# EasyEDA Pro project 2025-06-28（请勿使用）.epro, board PCB1
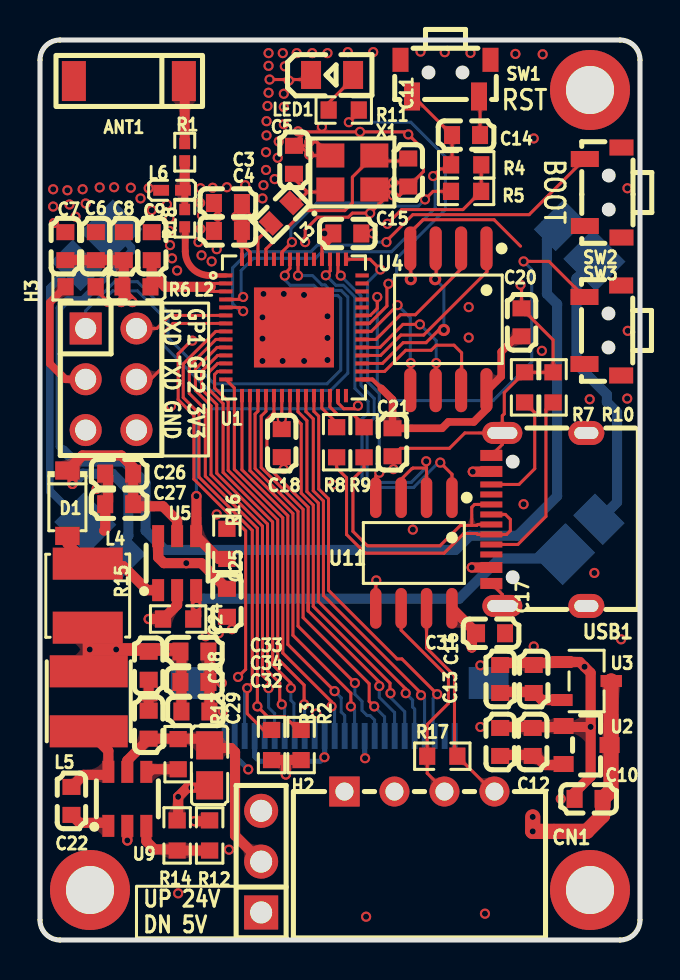
[diagram p1: board, top side]
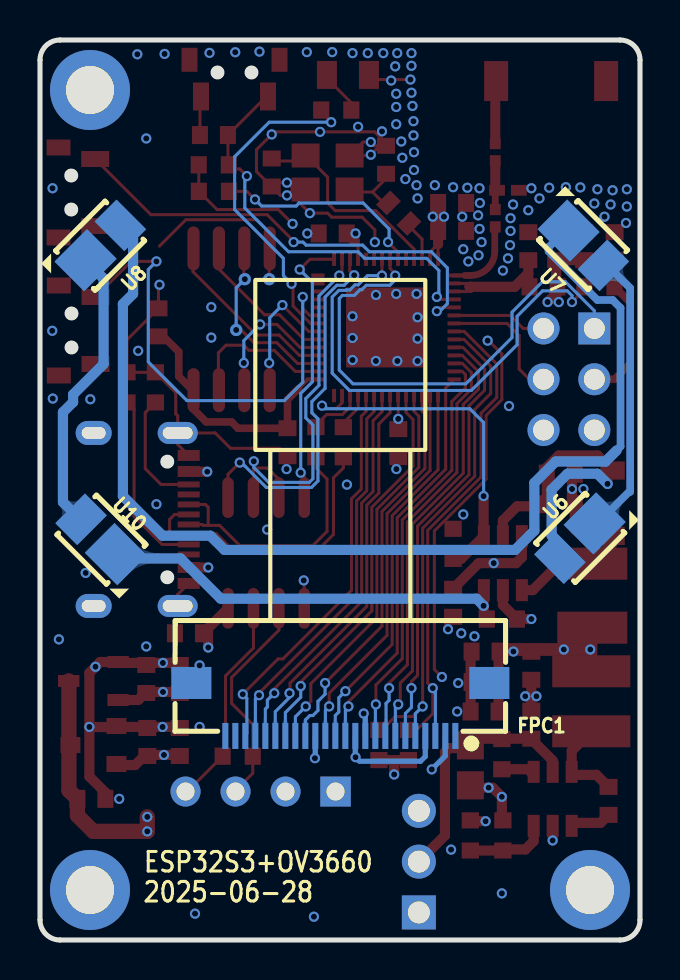
[diagram p2: board, bottom side, seen from below]

Outline 30 x 45 mm; copper layers: Top Layer, Inner1, Inner2, Bottom Layer. Coordinates in mm from the lower left corner of the outline.
Outline path: 0,44 0,1 arc(0.29,0.29) 1,0 29,0 arc(29.71,0.29) 30,1 30,44 arc(29.71,44.71) 29,45 1,45 arc(0.29,44.71) 0,44
Stack: Top Layer 0.035mm 外层铜厚1oz / Dielectric1 0.2104mm 7628 RC49% 8.6mil / Inner1 0.0152mm 内层铜厚 / Dielectric2 1.065mm 1.1mm H/HOZ 含铜 / Inner2 0.0152mm 内层铜厚 / Dielectric3 0.2104mm 7628 RC49% 8.6mil / Bottom Layer 0.035mm 外层铜厚1oz

## Design rules (mm)
net USB_D-: DP1
net USB_D+: DP1
template: 自定义配置
spacing copperThickness1oz (default): track to track 0.102, other pairs 0.152 to 0.3
spacing copperThickness2oz: track to track 0.203, other pairs 0.152 to 0.3
track width copperThickness1oz (default): min 0.127, default 0.254, max 2.54
track width copperThickness2oz: min 0.203, default 0.254, max 2.54
differential pair differentialPair (default): width min 0.127, default 0.254, max 2.54; gap min 0.152, default 0.152
via viaSize (default): diameter min 0.5, default 0.508, max 10; hole min 0.3, default 0.305, max 6.299

## Placement (name value [footprint] x y rotation side)
ANT1  -  [CA-C03]  4.44 42.95 180 top
C3  10nF  [C0603]  9.4 36.85 0 top
C4  1uF  [C0603]  9.4 35.45 0 top
C5  12pF  [C0603]  12.7 39.01 90 top
C6  10uF  [C0603]  2.79 34.69 270 top
C7  1uF  [C0603]  1.27 34.69 270 top
C8  100nF  [C0603]  4.19 34.69 270 top
C9  100nF  [C0603]  5.59 34.69 270 top
C10  10uF  [C0603]  27.43 7.06 0 top
C11  12pF  [C0603]  18.41 38.38 90 top
C12  100nF  [C0603]  24.64 9.9 270 top
C13  10uF  [C0603]  23.01 9.9 270 top
C14  1uF  [C0603]  21.3 40.25 180 top
C15  100nF  [C0603]  15.37 35.33 180 top
C16  100nF  [C0603]  23.01 13.05 270 top
C17  10uF  [C0603]  24.69 13.05 270 top
C18  100nF  [C0603]  12.09 24.84 90 top
C20  100nF  [C0603]  24.08 30.88 270 top
C21  1uF  [C0603]  17.63 24.89 90 top
C22  100nF  [C0603]  1.57 6.95 270 top
C24  10uF  [C0603]  5.43 13.71 90 top
C25  1uF  [C0603]  9.34 16.86 90 top
C26  1uF  [C0603]  3.96 23.31 0 top
C27  1uF  [C0603]  3.96 21.79 0 top
C28  100nF  [C0603]  5.43 10.77 90 top
C29  22uF  [C0805]  8.48 8.73 90 top
C31  100nF  [C0603]  22.55 15.34 0 top
C32  10uF  [C0603]  7.77 11.43 180 top
C33  10uF  [C0603]  7.72 14.42 180 top
C34  10uF  [C0603]  7.72 12.9 180 top
CN1  ZX-XH2.54-4PWZ  [CONN-TH_4P-P2.50_ZX-XH2.54-4PWZ]  18.97 7.42 0 top
D1  1N5819W  [SOD-123_L2.7-W1.6-LS3.7-RD]  1.37 21.84 270 top
FPC1  AFC01-S24FCA-00  [FPC-SMD_24P-P0.50_AFC01-S24FCA-00]  14.98 11.53 0 bottom
H2  PZ254V-11-03P  [HDR-TH_3P-P2.54-V-M]  11.06 3.92 90 top
H3  2.54-2*3  [HDR-TH_6P-P2.54-V-R2-C3-S2.54_A2541WV-2X3P]  3.55 28.04 270 top
L2  2nH  [L0603]  4.82 32.66 0 top
L3  24nH  [IND-SMD_L1.6-W0.8]  12.06 36.34 45 top
L4  22uH  [IND-SMD_L4.0-W4.0]  2.39 17.22 90 top
L5  10uH  [IND-SMD_L4.0-W4.0_FNR40XXS]  2.44 11.93 90 top
L6  3nH  [L0402]  6.6 37.49 0 top
LED1  NCD0805R1  [LED0805-R-RD]  14.6 43.25 0 top
NOREF  -  [Pad_e84]  27.5 2.5 0 top
NOREF#2  -  [Pad_e89]  27.5 42.5 0 top
NOREF#3  -  [Pad_e87]  2.5 2.5 0 top
R1  0Ω  [R0402]  7.24 39.39 270 top
R2  4.7kΩ  [R0603]  13.05 9.75 270 top
R3  4.7kΩ  [R0603]  11.58 9.75 270 top
R4  10kΩ  [R0603]  21.31 38.76 0 top
R5  10kΩ  [R0603]  21.3 37.43 0 top
R6  499Ω  [R0603]  2.03 32.66 180 top
R7  5.1kΩ  [R0603]  24.23 27.63 270 top
R8  22Ω  [R0603]  14.83 24.89 90 top
R9  22Ω  [R0603]  16.2 24.89 90 top
R10  5.1kΩ  [R0603]  25.65 27.63 270 top
R11  10kΩ  [R0603]  15.19 41.5 0 top
R12  7.5kΩ  [R0603]  8.48 5.23 90 top
R13  10kΩ  [R0603]  6.91 9.29 90 top
R14  2.4kΩ  [R0603]  6.86 5.23 270 top
R15  5.1Ω  [R0603]  6.91 16.05 0 top
R16  10kΩ  [R0603]  9.34 19.81 270 top
R17  120Ω  [R0603]  20.12 9.19 0 top
R18  0Ω  [R0402]  7.24 36.09 270 top
SW1  TS24CA 250gf 013  [SW-SMD_L4.7-W3.5-P3.35-EH]  20.28 43.09 0 top
SW2  TS24CA 250gf 013  [SW-SMD_L4.7-W3.5-P3.35-EH]  28.16 37.37 270 top
SW3  TS24CA 250gf 013  [SW-SMD_L4.7-W3.5-P3.35-EH]  28.14 30.48 270 top
U1  ESP32-S3R8  [QFN-56_L7.0-W7.0-P0.40-TL-EP4.0]  12.7 30.63 0 top
U2  ME6206A28XG  [SOT-23_L2.9-W1.3-P1.90-LS2.4-BR]  27.33 9.75 180 top
U3  ME6206A15XG  [SOT-23-3_L2.9-W1.6-P1.90-LS2.8-BR]  27.33 12.95 180 top
U4  W25Q64JVSSIQ  [SOP-8_L5.3-W5.3-P1.27-LS8.0-BL]  20.42 31.03 180 top
U5  SY7200AABC  [SOT-23-6_L2.9-W1.6-P0.95-LS2.8-BR]  6.86 18.84 270 top
U6  A2835W6H2-D01-8D2AB5  [LED-SMD_L3.5-W2.8-FD-2835_WHITE]  3.14 19.96 135 bottom
U7  A2835W6H2-D01-8D2AB5  [LED-SMD_L3.5-W2.8-FD-2835_WHITE]  2.7 34.6 45 bottom
U8  A2835W6H2-D01-8D2AB5  [LED-SMD_L3.5-W2.8-FD-2835_WHITE]  26.85 34.86 315 bottom
U9  JW5026  [SOT-23-6_L2.9-W1.6-P0.95-LS2.8-BR]  4.37 7.06 270 top
U10  A2835W6H2-D01-8D2AB5  [LED-SMD_L3.5-W2.8-FD-2835_WHITE]  27.07 20.16 225 bottom
U11  SP3485EEN(UMW)  [SOP-8_L5.0-W4.0-P1.27-LS6.0-BL]  18.69 19.35 180 top
USB1  TYPE-C 16PIN 2MD(073)  [USB-C-SMD_TYPE-C-6PIN-2MD-073]  24.94 21.03 90 top
X1  40MHz  [CRYSTAL-SMD_4P-L3.2-W2.5-BL_SIT8008BI]  15.62 38.38 0 top

## Footprints (pads in the part's own frame, mm; a bottom-side part is the same pattern mirrored in y, then rotated)
C0603
  rect 0.8x0.9 smd: 1(-0.7,0) 2(0.7,0)
C0805
  rect 1.41x1.35 smd: 1(-1,0) 2(1,0)
CA-C03
  rect 1.2x2 smd: 1(-2.75,0) 2(2.75,0)
CONN-TH_4P-P2.50_ZX-XH2.54-4PWZ
  rect 1.524x1.5 hole 0.9: 1(-3.75,0)
  round 1.5 hole 0.9: 2(-1.25,0) 3(1.25,0) 4(3.75,0)
CRYSTAL-SMD_4P-L3.2-W2.5-BL_SIT8008BI
  rect 1.4x1.2 smd: 1(-1.1,-0.85) 2(1.1,-0.85) 3(1.1,0.85) 4(-1.1,0.85)
FPC-SMD_24P-P0.50_AFC01-S24FCA-00
  rect 0.3x1.3 smd: 1(-5.75,1.325) 2(-5.25,1.325) 3(-4.75,1.325) 4(-4.25,1.325) 5(-3.75,1.325) 6(-3.25,1.325) 7(-2.75,1.325) 8(-2.25,1.325) 9(-1.75,1.325) 10(-1.25,1.325) 11(-0.75,1.325) 12(-0.25,1.325) 13(0.25,1.325) 14(0.75,1.325) 15(1.25,1.325) 16(1.75,1.325) 17(2.25,1.325) 18(2.75,1.325) 19(3.25,1.325) 20(3.75,1.325) 21(4.25,1.325) 22(4.75,1.325) 23(5.25,1.325) 24(5.75,1.325)
  rect 2x1.6 smd: 25(7.449,-1.325) 26(-7.45,-1.325)
HDR-TH_3P-P2.54-V-M
  rect 1.7x1.7 hole 1.1: 1(-2.54,0)
  round 1.7 hole 1.1: 2(0,0) 3(2.54,0)
HDR-TH_6P-P2.54-V-R2-C3-S2.54_A2541WV-2X3P
  rect 1.6x1.6 hole 1.05: 1(-2.54,-1.27)
  round 1.6 hole 1.05: 2(-2.54,1.27) 3(0,-1.27) 4(0,1.27) 5(2.54,-1.27) 6(2.54,1.27)
IND-SMD_L1.6-W0.8
  rect 0.762x1 smd: 1(-0.724,0) 2(0.724,0)
IND-SMD_L4.0-W4.0
  rect 1.6x3.5 smd: 1(-1.6,0) 2(1.6,0)
IND-SMD_L4.0-W4.0_FNR40XXS
  rect 1.6x3.9 smd: 1(-1.5,0) 2(1.5,0)
L0402
  rect 0.79x0.54 smd: 1(-0.545,0) 2(0.545,0)
L0603
  rect 0.8x0.864 smd: 1(-0.7,0) 2(0.7,0)
LED0805-R-RD
  rect 1x1.399 smd: 1(1.05,0) 2(-1.05,0)
LED-SMD_L3.5-W2.8-FD-2835_WHITE
  rect 2.3x2.1 smd: 1(1.231,0)
  rect 1.55x2.1 smd: 2(-1.232,0)
Pad_e84
  round 4 hole 2.4: 1(0,0)
Pad_e87
  round 4 hole 2.4: 1(0,0)
Pad_e89
  round 4 hole 2.4: 1(0,0)
QFN-56_L7.0-W7.0-P0.40-TL-EP4.0
  rect 0.665x0.2 smd: 1(-3.408,2.6) 2(-3.408,2.2) 3(-3.408,1.8) 4(-3.408,1.4) 5(-3.408,1) 6(-3.408,0.6) 7(-3.408,0.2) 8(-3.408,-0.2) 9(-3.408,-0.6) 10(-3.408,-1) 11(-3.408,-1.4) 12(-3.408,-1.8) 13(-3.408,-2.2) 14(-3.408,-2.6) 29(3.408,-2.6) 30(3.408,-2.2) 31(3.408,-1.8) 32(3.408,-1.4) 33(3.408,-1) 34(3.408,-0.6) 35(3.408,-0.2) 36(3.408,0.2) 37(3.408,0.6) 38(3.408,1) 39(3.408,1.4) 40(3.408,1.8) 41(3.408,2.2) 42(3.408,2.6)
  rect 0.2x0.665 smd: 15(-2.6,-3.408) 16(-2.2,-3.408) 17(-1.8,-3.408) 18(-1.4,-3.408) 19(-1,-3.408) 20(-0.6,-3.408) 21(-0.2,-3.408) 22(0.2,-3.408) 23(0.6,-3.408) 24(1,-3.408) 25(1.4,-3.408) 26(1.8,-3.408) 27(2.2,-3.408) 28(2.6,-3.408) 43(2.6,3.408) 44(2.2,3.408) 45(1.8,3.408) 46(1.4,3.408) 47(1,3.408) 48(0.6,3.408) 49(0.2,3.408) 50(-0.2,3.408) 51(-0.6,3.408) 52(-1,3.408) 53(-1.4,3.408) 54(-1.8,3.408) 55(-2.2,3.408) 56(-2.6,3.408)
  rect 4x4 smd: 57(0,0)
R0402
  rect 0.566x0.54 smd: 1(-0.433,0) 2(0.433,0)
R0603
  rect 0.806x0.864 smd: 1(-0.753,0) 2(0.753,0)
SOD-123_L2.7-W1.6-LS3.7-RD
  rect 0.91x1.22 smd: 1(-1.635,0) 2(1.635,0)
SOP-8_L5.0-W4.0-P1.27-LS6.0-BL
  oval 0.574x2.035 smd: 1(-1.905,-2.768) 2(-0.635,-2.768) 3(0.635,-2.768) 4(1.905,-2.768) 5(1.905,2.768) 6(0.635,2.768) 7(-0.635,2.768) 8(-1.905,2.768)
SOP-8_L5.3-W5.3-P1.27-LS8.0-BL
  oval 0.609x2.204 smd: 1(-1.905,-3.542) 2(-0.635,-3.542) 3(0.635,-3.542) 4(1.905,-3.542) 5(1.905,3.542) 6(0.635,3.542) 7(-0.635,3.542) 8(-1.905,3.542)
SOT-23-3_L2.9-W1.6-P1.90-LS2.8-BR
  rect 1.07x0.6 smd: 1(1.235,-0.95) 2(1.235,0.95) 3(-1.235,0)
SOT-23-6_L2.9-W1.6-P0.95-LS2.8-BR
  rect 1.1x0.6 smd: 1(1.35,-0.95) 2(1.35,0) 3(1.35,0.95) 4(-1.35,0.95) 5(-1.35,0) 6(-1.35,-0.95)
SOT-23_L2.9-W1.3-P1.90-LS2.4-BR
  rect 1x0.8 smd: 1(1.15,-0.95) 2(1.15,0.95) 3(-1.15,0)
SW-SMD_L4.7-W3.5-P3.35-EH
  rect 0.8x1.4 smd: 1(-1.675,-0.917) 2(1.675,-0.917)
  rect 0.8x1.2 smd: 3(-2.25,0.917) 4(2.25,0.917)
USB-C-SMD_TYPE-C-6PIN-2MD-073
  rect 0.55x1.1 smd: 1(-3.2,2.375) 2(-2.4,2.375) 11(2.4,2.375) 12(3.2,2.375)
  rect 0.3x1.1 smd: 3(-1.75,2.375) 4(-1.25,2.375) 5(-0.75,2.375) 6(-0.25,2.375) 7(0.25,2.375) 8(0.75,2.375) 9(1.25,2.375) 10(1.75,2.375)
  oval 1.1x2 hole 0.6x1.5: 13(-4.325,1.825) 14(4.325,1.825)
  oval 1.2x1.8 hole 0.6x1.2: 13(-4.325,-2.375) 14(4.325,-2.375)

## Nets
As in the schematic, except:
GND: C3.1 C4.1 C5.2 C6.1 C7.1 C8.1 C9.1 C10.1 C11.1 C12.1 C13.1 C14.1 C15.1 C16.1 C17.1 C18.1 C20.1 C21.1 C24.1 C25.1 C26.1 C27.1 C28.2 C29.1 C31.2 C32.1 C33.1 C34.1 CN1.2 FPC1.2 FPC1.15 FPC1.25 FPC1.26 H3.5 L6.1 LED1.2 NOREF.1 NOREF#2.1 NOREF#3.1 R7.1 R10.1 R14.1 R15.1 R16.1 SW1.2 SW1.3 SW1.4 SW2.2 SW2.3 SW2.4 SW3.2 SW3.3 SW3.4 U1.57 U2.1 U3.1 U4.4 U5.2 U9.2 U11.5 USB1.1 USB1.12 USB1.13 USB1.14 X1.2 X1.4

Pads without a net: ANT1 2; FPC1 1 23 24; U1 28 38 39 40 41 42 47 48 52; USB1 3 9

## Via types
v1: diameter 0.508, hole 0.299, Top Layer to Bottom Layer, 43 vias
v2: diameter 0.508, hole 0.305, Top Layer to Bottom Layer, 154 vias
v3: diameter 0.61, hole 0.305, Top Layer to Bottom Layer, 3 vias

## Routing (per net, layer and track width the routed paths; a pad name or vN(x,y) marks a point on that pad's centre or on a via; arc(x,y) is an arc through that point)
5V: length 1.9
  Top Layer w0.508: v1(21.59,18.63) USB1.2 ; v1(21.64,23.41) 22.55,23.41 USB1.11
24V_5V: length 12.9
  Top Layer w0.508: H2.2 9.75,5.22 9.75,9.39 9.55,9.6 8.62,9.6 C29.2 8.15,10.06 C28.1 5.43,10.04 4.37,8.97 4.37,8.26
GND: length 109.4
  Top Layer w0.152: 18.48,33.57 18.48,35.35 19.15,36.01 22.71,36.01 24.03,34.69 ; C21.1 18.02,24.58 20.47,24.58 21.24,25.35 USB1.14 ; C14.1 22,42.12 SW1.2 ; 13.01,39.71 v2(13.46,39.26) 13.5,39.22 X1.4 13.84,39.9 v2(13.46,39.9) 13.27,39.71 13.01,39.71 ; 13.01,39.71 12.57,39.71 13.27,40.41 v2(16,40.41) 18.29,40.41 v2(18.41,40.28) 19.18,39.52 19.18,38.43 17.98,37.23 17.97,37.23 ; 17.31,37.53 X1.2 ; 17.31,37.53 v2(17.65,37.87) 18.22,37.87 C11.1 17.97,37.23 ; 17.31,37.53 17.36,37.53 v2(17.65,37.23) ; v2(11.48,43.02) 13.12,43.02 13.55,43.45 ; USB1.14 23.12,26.21 23.21,26.31 23.21,27.37 R7.1 R10.1 25.65,30.01 C20.1 24.08,32.71 v1(24.03,32.76) ; USB1.14 23.12,24.78 USB1.12 ; v1(9.9,13.15) 10.28,13.53 10.28,20.45 7.69,23.04 7.69,26.23 6.91,27.02 6.91,29.31 7.57,29.97 v2(7.62,29.97) ; v3(18.54,33.04) 18.54,34.55 ; v2(17.65,37.23) 17.4,37.23 v2(16.51,36.34) 15.62,36.34 15.42,36.14 13.89,36.14 13.26,35.5 v2(13.26,34.89) ; v2(17.65,37.23) 17.97,37.23 ; v2(16.81,17.98) 16.79,17.95 U11.5 ; v1(9.09,12.85) 8.47,12.85 C34.1 ; USB1.13 23.12,17.28 USB1.1
  Top Layer w0.508: v2(27.53,10.66) 27.53,8.17 26.73,7.37 C10.1 ; v2(27.53,10.66) 27.53,13.36 v2(27.23,13.66) 26.99,13.9 26.19,13.9 26.15,13.85 v2(23.86,13.85) 22.96,13.85 ; v2(27.53,10.66) 27.53,10.65 26.25,10.65 26.24,10.65 v2(23.87,10.65) 23.01,10.65 ; C33.1 8.47,14.37 C32.1 ; C24.1 C28.2 ; v1(4.37,4.98) 4.37,5.86 ; v1(5.43,16.05) R15.1 6.86,16.75 U5.2 ; R14.1 6.91,6.03 v1(6.91,7.16) 7.36,7.62 v1(7.57,7.62) 8.36,7.62 C29.1 ; C26.1 3.4,23.17 v2(3.4,22.55) 3.4,21.93 C27.1 3.26,20.52 3.21,20.47
  Bottom Layer w0.152: v2(16.81,17.98) 16.81,17.93
  Bottom Layer w0.254: v2(16.25,9.09) 16.23,9.11 FPC1.15 ; FPC1.2 9.73,9.21 v2(10.41,8.53)
  vias: v1(5.18,12.19) v1(5.74,12.19) v1(8.28,15.19) v1(8.94,15.34) v1(9.6,15.54) v1(11.12,31.14) v1(11.17,32.3) v1(21.44,30.12) v1(27.49,27.04) v1(27.72,18.35) v2(0.66,37.54) v2(0.66,36.67) v2(0.7,35.85) v2(1.37,37.49) v2(1.47,36.78) v2(1.78,36.17) v2(2.13,37.54) v2(2.28,36.83) v2(2.83,22.55) v2(2.98,37.63) v2(3.71,37.64) v2(4.54,37.61) v2(5.03,37.08) v2(5.43,37.59) v2(5.59,36.49) v2(6.35,36.78) v2(6.47,36.09) v2(6.47,35.45) v2(6.5,34.74) v2(6.6,34.08) v2(6.55,26.7) v2(6.86,33.47) v2(6.91,2.33) v2(7.92,34.89) v2(8.02,37.59) v2(8.01,36.85) v2(8.02,35.56) v2(8.1,36.23) v2(8.07,34.23) v2(8.63,37.61) v2(8.58,33.93) v2(8.84,34.54) v2(8.84,21.28) v2(8.89,36.17) v2(9.14,11.43) v2(9.34,37.64) v2(9.45,4.52) v2(10.26,37.74) v2(11.12,37.08) v2(11.12,30.07) v2(11.12,28.95) v2(11.17,37.74) v2(11.33,40.94) v2(11.33,40.23) v2(11.3,39.39) v2(11.3,38.5) v2(11.43,44.34) v2(11.43,43.71) v2(11.43,42.36) v2(11.38,41.7) v2(11.73,38.05) v2(11.94,39.92) v2(11.88,39.11) v2(12.14,44.34) v2(12.13,28.95) v2(12.24,43.68) v2(12.19,42.31) v2(12.19,41.65) v2(12.19,40.79) v2(12.19,32.3) v2(12.18,23.55) v2(12.44,42.97) v2(12.84,44.34) v2(12.9,40.43) v2(13.2,32.25) v2(13.21,28.95) v2(13.61,44.34) v2(14.09,40.66) v2(14.37,44.34) v2(14.37,31.19) v2(14.37,30.1) v2(14.37,29) v2(14.66,22.77) v2(15.39,44.39) v2(16.31,1.16) v2(16.63,35.33) v2(16.66,44.39) v2(17.67,23.54) v2(18.64,20.52) v2(19.03,44.42) v2(20.24,44.39) v2(21.44,31.64) v2(21.53,44.35) v2(22.02,13.73) v2(22.02,10.65) v2(22.25,1.32) v2(23.77,44.3) v2(24.18,21.79) v2(24.69,40.08) v2(24.69,14.68) v2(25.13,44.29) v2(25.09,29.46) v2(26.04,7.06) v2(29.06,15.03) v2(29.37,37.59) v2(29.39,30.46) v2(29.36,27.07)
VDD3P3: length 6.8
  Top Layer w0.152: 8.44,32.66 8.27,32.83 U1.2 ; U1.3 8.67,32.43 8.49,32.61
  Top Layer w0.508: 5.59,33.34 6.26,32.66 8.52,32.66 8.48,32.62 8.49,32.61 ; 5.59,33.34 5.59,32.72 L2.2 ; 5.59,33.34 C9.2
VDD_SPI: length 13
  Top Layer w0.203: U1.29 16.62,28.03 17.07,27.58
  Top Layer w0.381: 17.07,27.58 17.63,27.02 C21.2 20.1,25.59 20.42,25.9 21.69,25.9 22.35,26.56 22.35,27.47 23.06,28.18 23.06,29.41 23.83,30.18 C20.2
1P5V: length 4.6
  Top Layer w0.508: 22.96,12.45 23.01,12.4 v2(23.85,12.4) 24.69,12.4 25.09,12 26.19,12
  Bottom Layer w0.254: v1(13.82,11.32) 13.73,11.24 FPC1.10
2P8V: length 9.3
  Top Layer w0.508: 26.25,8.75 25.24,8.75 24.69,9.3 24.64,9.25 v2(23.8,9.25) 23.01,9.25
  Bottom Layer w0.254: FPC1.11 14.23,9.15 v1(14.22,9.14) 14.02,8.94 10.97,8.94 10.73,9.17 FPC1.4
3P3V: length 53.4
  Top Layer w0.152: 12.29,8.99 12.29,9 ; C18.2 12.09,25.55 v2(12.09,26.06) 12.09,27.21 U1.20 ; C3.2 10.36,36.59 v2(10.36,36.17) ; 14.66,35.33 v2(14.22,35.33) 14.1,35.2 U1.46 ; U1.56 10.1,34.8 10.5,34.4 U1.55 ; R4.2 22.06,37.44 R5.2 21.15,36.52 18.08,36.52 v2(17.37,35.81)
  Top Layer w0.508: C7.2 C6.2 C8.2 4.19,32.72 ; 4.82,25.59 5.01,25.59 ; 4.82,25.59 4.82,25.62 ; 4.82,25.59 4.55,25.59 4.4,25.45 ; 4.19,32.33 4.12,32.39 L2.1 ; 4.19,32.33 v2(4.62,31.9) ; 4.19,32.33 4.19,32.03 v2(4.06,31.9) ; R3.2 R2.2 ; U11.8 21.6,15.58 21.6,14.64 v2(21.59,14.63) ; C3.2 C4.2 10.1,34.8 10.1,34.8 ; U5.6 5.91,19.13 6.2,18.84 v2(7.31,18.84) 8.06,18.84 C25.2 ; L4.1 2.39,13.48 2.44,13.43 ; R12.2 8.44,5.94 v1(7.72,5.94) ; C32.2 7.07,14.37 C33.2 ; v2(12.29,8.28) 12.29,8.99 ; 14.66,35.33 14.27,34.94 14.27,34.89
  Top Layer w0.635: v1(2.49,14.52) v1(3.81,14.52) 6.92,14.52 C33.2
  Top Layer w0.762: v2(24.64,6.16) v2(24.64,5.43) 27.34,5.43 28.13,6.23 C10.2 28.55,7.48 28.55,12.94 U3.3
  vias: v2(6.33,14.42) v2(9.8,36.17)
485_A: length 11
  Top Layer w0.152: 20.27,7.42 19.36,8.33 R17.1 19.36,10.77 20.42,11.83 20.42,13.13 18.06,15.49 U11.6
485_B: length 10.7
  Top Layer w0.152: U11.7 19.33,14.6 20.72,13.2 20.72,9.33 R17.2 22.64,7.42 22.77,7.42
485_EN: length 19.8
  Top Layer w0.152: 19.33,23.6 18.65,23.6 18.62,23.57 18.59,23.57 18.06,23.03 U11.3 ; 19.33,23.6 U11.2 ; 19.33,23.6 19.31,23.61 v2(19.31,23.94) ; U1.44 14.9,33.36 v2(15.04,33.22)
  Bottom Layer w0.152: v2(15.04,33.22) 16.05,32.2 16.05,27.73 16.71,27.07 16.71,26.11 16.36,25.75 16.36,23.06 16.53,22.88 18.57,22.88 19.31,23.63 v2(19.31,23.94)
BOOT: length 23.3
  Top Layer w0.152: v1(10.16,31.44) 9.97,31.63 U1.5 ; SW2.1 24.46,36.27 18.64,36.27 17.32,34.95 v2(17.32,34.89)
  Bottom Layer w0.152: v2(17.32,34.89) 16.85,34.89 16.7,34.74 13.87,34.74 13.54,34.41 10.44,34.41 9.63,33.61 9.63,31.81 10.01,31.44 v1(10.16,31.44)
D2: length 19.3
  Top Layer w0.152: U1.21 12.5,26.36 13.06,25.8 13.06,22.35 13.66,21.74 13.66,16.68 17.5,12.84 17.5,12.36 v1(17.52,12.34)
  Bottom Layer w0.152: 18.24,10.26 18.24,11.41 17.52,12.12 v1(17.52,12.34)
D3: length 19.4
  Top Layer w0.152: v1(19.05,12.24) 19.05,12.34 14.17,17.22 14.17,21.95 13.66,22.46 13.66,26.06 13.3,26.42 U1.23
  Bottom Layer w0.152: 19.23,10.26 19.23,12.06 v1(19.05,12.24)
D4: length 19.8
  Top Layer w0.152: v1(19.86,12.29) 18.1,14.05 17.86,14.05 14.43,17.48 14.43,22.06 13.94,22.55 13.94,26.19 13.7,26.43 U1.24
  Bottom Layer w0.152: 19.73,10.26 19.66,10.34 19.66,12.09 v1(19.86,12.29)
D5: length 19.4
  Top Layer w0.152: v1(18.29,12.34) 18.29,12.56 13.92,16.92 13.92,21.85 13.35,22.42 13.35,25.97 12.9,26.42 U1.22
  Bottom Layer w0.152: v1(18.29,12.34) 18.63,11.99 18.63,11.65 18.73,11.55 FPC1.20
D6: length 20.1
  Top Layer w0.152: U1.19 11.7,26.38 11.35,26.02 11.35,23.7 13.41,21.64 13.41,16.45 ; v1(16.97,12.7) 16.97,12.9 13.41,16.45 ; 13.41,16.45 13.41,16.85
  Bottom Layer w0.152: v1(16.97,12.7) 16.97,12.14 17.73,11.37 17.73,10.26
D7: length 19.6
  Top Layer w0.152: U1.17 10.9,26.44 10.75,26.3 10.75,23.57 12.9,21.43 12.9,15.69 v1(15.75,12.85)
  Bottom Layer w0.152: v1(15.75,12.85) 15.75,12.29 16.1,11.93 16.1,11.48 16.36,11.22 16.51,11.22 16.73,11 16.73,10.26
D8: length 19.1
  Top Layer w0.152: v1(15.54,11.68) 15.54,12.34 12.65,15.24 12.65,21.32 10.5,23.47 U1.16
  Bottom Layer w0.152: v1(15.54,11.68) 15.73,11.49 15.73,10.26
D9: length 20
  Top Layer w0.152: U1.14 9.72,27.6 9.72,23.53 12.14,21.11 12.14,14.35 14.58,11.91 v1(14.58,11.68)
  Bottom Layer w0.152: 14.73,10.26 14.73,11.53 v1(14.58,11.68)
GPIO1: length 5.3
  Top Layer w0.152: 4.82,30.58 5.84,30.58 6.49,31.23 U1.6
  Bottom Layer w0.152: 4.88,30.58 4.32,30.58
GPIO2: length 6.6
  Top Layer w0.152: H3.4 5.53,28.04 6.04,28.55 6.04,30.22 6.65,30.83 U1.7
HREF: length 20.5
  Top Layer w0.152: U1.13 8.88,28.43 8.73,28.28 8.73,27.6 9.41,26.92 9.41,23.48 11.88,21.01 11.88,14.07 13.21,12.75 v1(13.21,11.78)
  Bottom Layer w0.152: v1(13.21,11.78) 13.23,11.76 13.23,10.26
LED: length 16.6
  Top Layer w0.152: v2(15.44,40.89) 15.94,41.39 R11.2 ; U1.36 16.47,30.83 17.35,31.7 17.35,32.74 v2(17.42,32.81)
  Bottom Layer w0.152: v2(17.42,32.81) 17.83,33.22 17.83,34.08 20.27,36.52 20.27,39.16 18.54,40.89 v2(15.44,40.89)
LED_N: length 20.7
  Top Layer w0.508: R15.2 7.81,16.19 U5.3
  Bottom Layer w0.508: v2(7.82,16.71) 8.18,17.06 20.96,17.06 22.97,19.08 26.04,19.08
LED_P: length 16.6
  Top Layer w0.508: U5.5 6.86,20.98 6.15,21.69 4.76,21.69 C27.2 C26.2 4.66,23.63 4.06,24.23 2.12,24.23 D1.1 1.62,23.22 v2(1.62,22.81)
  Bottom Layer w0.508: v2(1.62,22.81) 2.13,23.31 3.62,23.31 4.42,22.52 4.42,20.21 3.62,19.42 3.62,19.33
LED_PWM: length 17.7
  Top Layer w0.152: U1.27 14.9,26.85 15.19,26.56 15.75,26.56 v2(15.9,26.72)
  Top Layer w0.508: v2(7.82,22.19) 7.82,20.21 U5.4 8.94,19.05 R16.2
  Bottom Layer w0.152: v2(7.82,22.19) 7.82,25.88 8.51,26.56 15.75,26.56 v2(15.9,26.72)
PCLK: length 19.6
  Top Layer w0.152: U1.18 11.3,26.43 11.06,26.2 11.06,23.63 13.16,21.53 13.16,16.12 16.46,12.82 16.46,11.93 v1(16.71,11.68)
  Bottom Layer w0.152: 17.23,10.26 17.23,11.16 v1(16.71,11.68)
PWDN: length 20.9
  Top Layer w0.152: U1.12 8.88,28.83 8.43,28.38 8.43,27.54 9.16,26.82 9.16,23.38 11.63,20.9 11.63,13.76 12.55,12.85 v1(12.55,12.59)
  Bottom Layer w0.152: v1(12.55,12.59) 12.55,11.98 12.7,11.83 12.7,10.3 12.73,10.26
RESET: length 20.4
  Top Layer w0.152: SW1.1 18.67,42.18 C14.2 20.6,38.81 R4.1 20.35,38.55 20.01,38.55 v2(19.66,38.2) ; U1.4 10.03,32.03 v1(10.16,32.15)
  Bottom Layer w0.152: 10.21,32.15 10.06,32.3 10.06,33.47 10.67,34.08 13.77,34.08 14.1,34.41 17.57,34.41 19.76,36.6 19.76,38.15 19.71,38.2
RESETB: length 21.9
  Top Layer w0.152: U1.10 8.85,29.63 7.77,28.55 7.77,27.49 8.55,26.7 8.55,23.26 11.12,20.69 11.12,13.23 11.43,12.92 v1(11.43,12.59)
  Bottom Layer w0.152: v1(11.43,12.59) 11.43,11.63 11.73,11.33 11.73,10.26
RXD: length 19
  Top Layer w0.152: U11.1 20.6,23.29 v2(20.01,23.87) ; v2(14.29,33.24) 14.51,33.46 14.51,34.06
  Bottom Layer w0.152: v2(14.29,33.24) 14.79,32.74 15.16,32.74 15.75,32.15 15.75,27.58 16.41,26.92 16.41,26.36 16.1,26.06 16.1,22.95 16.43,22.63 18.68,22.63 19.93,23.87 v2(20.01,23.87)
SIO_C: length 25
  Top Layer w0.152: U1.9 8.8,30.03 7.47,28.7 7.47,27.33 8.27,26.53 8.27,23.19 10.87,20.59 v1(10.87,11.68) 11.38,11.17 12.24,11.17 12.91,10.5 R2.1
  Bottom Layer w0.152: v1(10.87,11.68) 11.23,11.32 11.23,10.26
SIO_D: length 25.6
  Top Layer w0.152: U1.8 8.79,30.43 7.16,28.8 7.16,27.12 7.95,26.34 7.95,23.15 10.62,20.48 10.62,12.85 v1(10.36,12.59) 10.36,11.31 11.34,10.34
  Bottom Layer w0.152: 10.23,10.26 10.23,12.46 v1(10.36,12.59)
SPICLK: length 7
  Top Layer w0.152: v2(19.81,28.85) 19.81,27.47 ; U1.33 17,29.63 18.15,30.78 v2(19,30.78)
  Bottom Layer w0.152: v2(19,30.78) 19.81,29.97 v2(19.81,28.85)
SPICS0: length 9.1
  Top Layer w0.152: 22.35,34.55 22.35,33.41 19.18,30.25 18.05,30.25 17.03,29.23 U1.32
SPID: length 6.9
  Top Layer w0.152: v1(18.54,28.85) 18.54,27.47 ; U1.35 16.56,30.43 v2(17.88,31.75)
  Bottom Layer w0.152: v1(18.54,28.85) 18.51,28.88 18.51,31.11 v2(17.88,31.75)
SPIHD: length 7.6
  Top Layer w0.152: 21.08,27.47 21.08,29.36 20.7,29.74 19.81,29.74 19.56,29.48 18.29,29.48 17.23,28.43 U1.30
SPIQ: length 7.4
  Top Layer w0.152: U1.34 16.8,30.03 18.03,31.26 18.77,31.26 21.08,33.57 21.08,34.55
SPIWP: length 9.1
  Top Layer w0.152: U1.31 17.12,28.83 18.16,29.87 19.3,29.87 19.94,30.5 v3(20.19,30.5) ; v3(19.76,33.04) 19.81,33.04 19.81,34.55
  Bottom Layer w0.152: v3(19.76,33.04) 20.19,32.61 v3(20.19,30.5)
TXD: length 13.9
  Top Layer w0.152: v2(16.97,23.36) 16.79,23.19 U11.4 ; v2(17.02,33.52) 16.5,34.04 U1.43
  Bottom Layer w0.152: v2(17.02,33.52) 16.38,32.89 16.38,27.91 16.97,27.33 v2(16.97,23.36)
U0RX: length 25.5
  Top Layer w0.152: U1.50 12.5,33.58 12.24,33.32 v2(12.24,33.22)
  Bottom Layer w0.152: v2(12.24,33.22) 12.24,33 12.51,32.74 13.69,32.74 13.91,32.52 14,32.52 14.29,32.23 14.88,32.23 15.03,32.08 15.03,28.49 14.35,27.81 8.71,27.81 6.4,30.12 6.4,31.39 4.88,32.91 3.74,32.91 2.28,31.46 2.28,31.08 1.78,30.58
U0TX: length 5.8
  Top Layer w0.381: 1.78,28.04 1.28,28.04 0.49,28.82 0.49,31.87 R6.2
USB_D+: length 13.5
  Top Layer w0.152: 21.57,20.73 21.59,20.75 21.59,21.64 21.73,21.78 USB1.8 ; 21.57,20.73 21.84,20.73 21.89,20.78 USB1.6 ; 21.57,20.73 21.02,20.73 20,19.71 16.37,19.71 15.65,20.43 15.65,23.05 16.2,23.6 R9.1
USB_D-: length 14.8
  Top Layer w0.152: USB1.7 23.27,21.28 23.52,21.03 23.52,20.47 23.33,20.28 USB1.5 21.89,20.28 21.84,20.32 21.19,20.32 20.21,19.34 16.26,19.34 15.33,20.27 15.33,23.11 14.83,23.6 R8.1
USB_R_D+: length 2.6
  Top Layer w0.152: 16.42,25.52 15.67,26.27 14.88,26.27 14.49,26.66 14.49,26.89
USB_R_D-: length 2.4
  Top Layer w0.152: 14.09,27.26 14.09,26.59 15.14,25.55 15.14,25.32
USR_BUT: length 23.6
  Top Layer w0.152: v2(24.18,33.93) 25.44,33.93 SW3.1 ; v2(16.86,32.15) 16.86,31.58 16.51,31.23 U1.37
  Bottom Layer w0.152: v2(24.18,33.93) 24.59,33.52 24.59,28.9 22.66,26.97 17.78,26.97 16.86,27.89 v2(16.86,32.15)
VSYNC: length 21.4
  Top Layer w0.152: v1(12.09,11.78) 11.99,11.88 11.99,12.85 11.38,13.46 11.38,20.8 8.84,23.34 8.84,26.78 8.07,27.54 8.07,28.42 8.88,29.23 U1.11
  Bottom Layer w0.152: v1(12.09,11.78) 12.23,11.64 12.23,10.26
XVCLK: length 19.1
  Top Layer w0.152: U1.15 10.1,23.51 12.39,21.22 12.39,14.78 v1(14.73,12.44)
  Bottom Layer w0.152: v1(14.73,12.44) 15.06,12.11 15.06,11.4 15.23,11.23 FPC1.13
$1N788: length 6
  Top Layer w0.152: USB1.10 23.95,22.78 24.74,23.57 24.74,26.37 R7.2
$1N789: length 9.2
  Top Layer w0.152: R10.2 25.3,26.52 25.3,21.18 23.89,19.78 USB1.4
$1N1772: length 2.1
  Top Layer w0.152: U1.54 10.9,35.05 11.56,35.7 11.68,35.7
$1N1802: length 10.2
  Top Layer w0.152: U1.53 11.3,34.55 13.22,36.47 15.24,36.47 15.62,36.85 15.62,38.14 16.42,38.95 18.41,38.95
$1N1812: length 3
  Top Layer w0.152: 13.37,37.4 12.83,36.86 12.57,36.86 ; 13.37,37.4 12.57,38.2 12.57,38.31 ; 13.37,37.4 14.14,37.4
$1N4260: length 10.7
  Top Layer w0.152: v2(12.6,34.89) 12.1,34.4 U1.51 ; 20.55,37.43 19.65,37.43 v2(19.25,37.03)
  Bottom Layer w0.152: v2(19.25,37.03) 18.92,36.7 17.19,36.7 17.04,36.85 13.84,36.85 12.55,35.56 12.55,34.95 v2(12.6,34.89)
$1N4634: length 24.2
  Top Layer w0.152: R6.1 2.78,32.52 v2(3.4,31.9) ; U1.49 12.9,34.03 v2(12.9,33.22)
  Bottom Layer w0.152: v2(12.9,33.22) 13.63,33.22 14.09,32.76 14.25,32.76 14.5,32.51 14.68,32.51 14.69,32.48 15.05,32.48 15.39,32.15 15.39,28.34 14.53,27.48 8.43,27.48 6.15,29.76 6.15,31.19 4.88,32.46 3.64,32.46 3.4,32.22 v2(3.4,31.9)
$1N5382: length 3.1
  Top Layer w0.5: R1.1 7.24,42.9
$1N7842: length 1.7
  Top Layer w0.508: 5.32,8.26 5.6,8.54 R13.1
$1N7844: length 4.7
  Top Layer w0.508: 2.44,10.44 3.42,9.45 3.42,8.26 2.17,8.26 C22.1
$1N7845: length 2
  Top Layer w0.508: 3.42,5.86 1.97,5.86 C22.2
$1N8031: length 4.3
  Top Layer w0.508: R12.1 7.06,4.47 7.01,4.53 5.73,4.53 5.32,4.94 5.32,5.86
$1N9498: length 5.9
  Top Layer w0.508: U5.1 5.36,17.49 4.16,18.69 2.51,18.69 L4.2 1.37,19.83 D1.2
$1N9979: length 57
  Bottom Layer w0.381: 3.72,35.68 3.72,35.49 4.57,34.64 4.57,34.44 2.13,32 1.37,32 0.97,31.6 0.97,24.67 1.17,24.48
  Bottom Layer w0.508: 25.98,35.68 25.35,35.05 25.35,32.3 25.85,31.8 25.85,22.19 23.87,20.21 21.49,20.21 20.78,19.5 6.25,19.5 5.28,20.47 5.28,22.86 4.21,23.92 1.72,23.92 1.17,24.48 ; 26.11,35.29 26.24,35.42
$1N9982: length 14.3
  Bottom Layer w0.381: 1.96,20.99 0.55,22.4 ; 0.49,22.4 0.49,32.59 2.02,34.12
$1N9996: length 15.2
  Bottom Layer w0.508: 27.93,34.19 26.82,33.08 26.82,28.8 28.34,27.28 28.34,26.89 28.85,26.39 28.85,21.89 27.7,20.74
$1N10529: length 2.4
  Top Layer w0.152: 15.65,43.45 15.65,43.08 14.43,41.86 14.43,41.55
$1N11616: length 4
  Top Layer w0.203: U1.1 8.76,33.23
  Top Layer w0.34: 8.76,33.23 8.47,33.23 arc(7.62,33.58) 7.26,34.44 7.26,35.63 arc(7.26,35.65) R18.2
$1N11617: length 2.5
  Top Layer w0.34: R18.1 7.24,37.4 arc(7.21,37.46) L6.2
  Top Layer w0.5: 7.28,37.51 7.24,37.56 R1.2

## Copper pours and planes (outline as drawn; the poured copper is in the pictures)
5V on Inner2: 9.75,24.14 29.74,24.14 29.74,0.26 9.75,0.26
24V on Inner2: 9.83,8.4 16.38,8.4 16.38,5.61 9.83,5.61
GND on Top Layer: -0.28,45.44 30.6,45.44 30.6,-0.64 -0.28,-0.64
GND on Bottom Layer: -0.71,45.46 30.53,45.46 30.53,-0.72 -0.71,-0.72
GND on Inner1: 0.26,44.74 29.74,44.74 29.74,0.26 0.26,0.26
GND on Inner2: 0.26,44.74 29.74,44.74 29.74,24.39 0.26,24.39
1P5V on Inner2: 13.34,13.84 25.47,13.84 25.47,10.54 13.34,10.54
2P8V on Inner2: 13.28,10.28 25.47,10.28 25.47,8.66 13.28,8.66
3P3V on Inner2: 0.26,36.49 25.47,36.49 25.47,0.26 0.26,0.26

Small or netless copper shapes (teardrops, artwork), in the pictures only: 336 on Top Layer, 70 on Bottom Layer

## Text on the board
Bottom Silkscreen Layer: ESP32S3+OV3660 | 2025-06-28
Top Silkscreen Layer: GP1 GP2 3V3 / RXD TXD GND | UP 24V / DN 5V | RST | BOOT
